# EAGLE design proto1 (EAGLE 7.7.0)
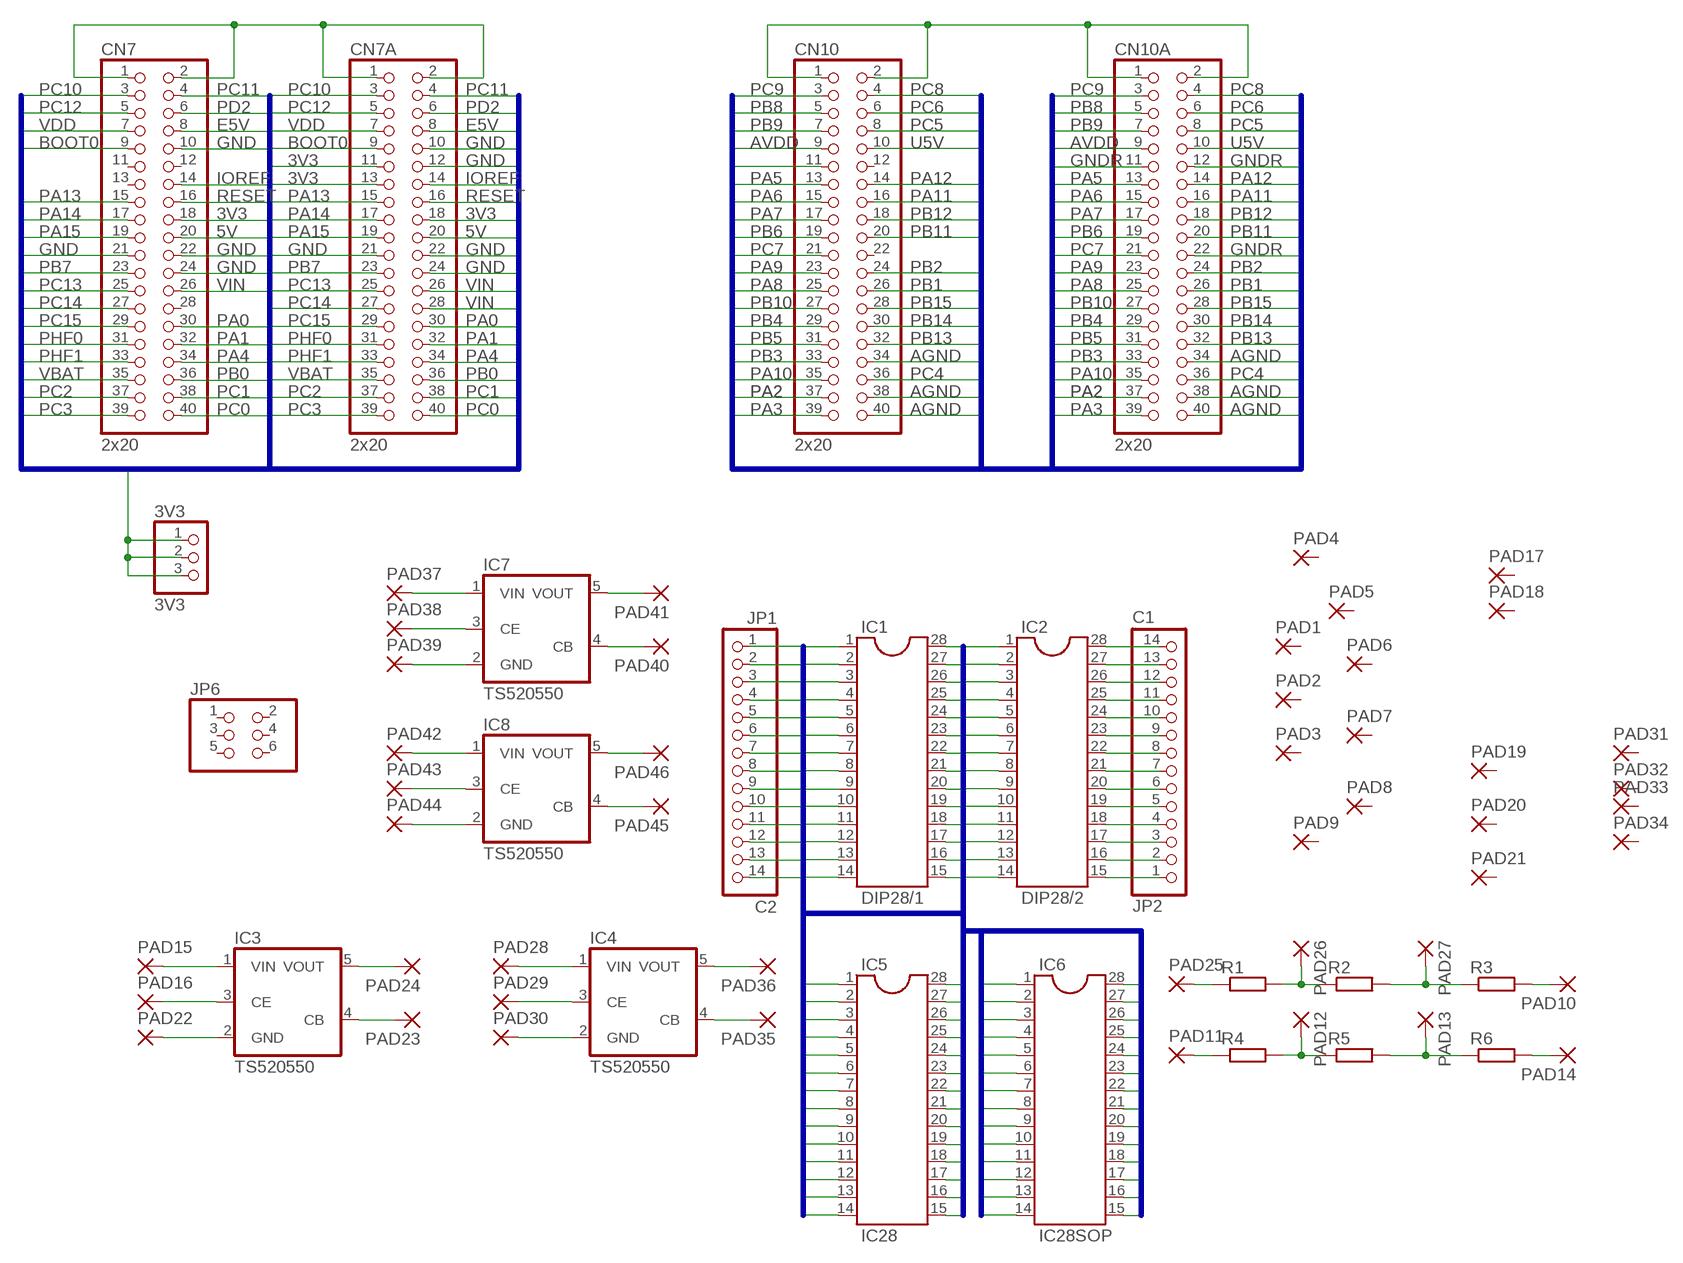
[diagram p0: schematic, sheet 1]

## Parts
3V3  3V3  PINHD-1X3  [1X03]
CN7  2x20  PINHD-2X20  [2X20]
CN7A  2x20  PINHD-2X20  [2X20]
CN10  2x20  PINHD-2X20  [2X20]
CN10A  2x20  PINHD-2X20  [2X20]
IC1  DIP28/1  DIL28  [DIL28-6]
IC2  DIP28/2  DIL28-3  [DIL28-3]
IC3  TS520550  [SOT25]
IC4  TS520550  [SOT25]
IC5  IC28  [SSOP28]
IC6  IC28SOP  [SOP28]
IC7  TS520550  [SOT25]
IC8  TS520550  [SOT25]
JP1  C2  PINHD-1X14  [1X14]
JP2  C1  PINHD-1X14  [1X14]
JP6  PINHD-2X3  [2X03]
PAD1  SMD2  [SMD1,27-2,54]
PAD2  SMD2  [SMD1,27-2,54]
PAD3  SMD2  [SMD1,27-2,54]
PAD4  SMD2  [SMD1,27-2,54]
PAD5  SMD2  [SMD1,27-2,54]
PAD6  SMD2  [SMD1,27-2,54]
PAD7  SMD2  [SMD1,27-2,54]
PAD8  SMD2  [SMD1,27-2,54]
PAD9  SMD2  [SMD1,27-2,54]
PAD10  SMD2  [SMD1,27-2,54]
PAD11  SMD2  [SMD1,27-2,54]
PAD12  SMD2  [SMD1,27-2,54]
PAD13  SMD2  [SMD1,27-2,54]
PAD14  SMD2  [SMD1,27-2,54]
PAD15  SMD2  [SMD1,27-2,54]
PAD16  SMD2  [SMD1,27-2,54]
PAD17  SMD2  [SMD1,27-2,54]
PAD18  SMD2  [SMD1,27-2,54]
PAD19  SMD2  [SMD1,27-2,54]
PAD20  SMD2  [SMD1,27-2,54]
PAD21  SMD2  [SMD1,27-2,54]
PAD22  SMD2  [SMD1,27-2,54]
PAD23  SMD2  [SMD1,27-2,54]
PAD24  SMD2  [SMD1,27-2,54]
PAD25  SMD2  [SMD1,27-2,54]
PAD26  SMD2  [SMD1,27-2,54]
PAD27  SMD2  [SMD1,27-2,54]
PAD28  SMD2  [SMD1,27-2,54]
PAD29  SMD2  [SMD1,27-2,54]
PAD30  SMD2  [SMD1,27-2,54]
PAD31  SMD2  [SMD1,27-2,54]
PAD32  SMD2  [SMD1,27-2,54]
PAD33  SMD2  [SMD1,27-2,54]
PAD34  SMD2  [SMD1,27-2,54]
PAD35  SMD2  [SMD1,27-2,54]
PAD36  SMD2  [SMD1,27-2,54]
PAD37  SMD2  [SMD1,27-2,54]
PAD38  SMD2  [SMD1,27-2,54]
PAD39  SMD2  [SMD1,27-2,54]
PAD40  SMD2  [SMD1,27-2,54]
PAD41  SMD2  [SMD1,27-2,54]
PAD42  SMD2  [SMD1,27-2,54]
PAD43  SMD2  [SMD1,27-2,54]
PAD44  SMD2  [SMD1,27-2,54]
PAD45  SMD2  [SMD1,27-2,54]
PAD46  SMD2  [SMD1,27-2,54]
R1  R-EU_R1206  [R1206]
R2  R-EU_R1206  [R1206]
R3  R-EU_R1206  [R1206]
R4  R-EU_R1206  [R1206]
R5  R-EU_R1206  [R1206]
R6  R-EU_R1206  [R1206]

## Nets
3V3: 3V3.1 3V3.2 3V3.3 CN7.18 CN7A.11 CN7A.13 CN7A.18
5V: CN7.20 CN7A.20
AGND: CN10.34 CN10.38 CN10.40 CN10A.34 CN10A.38 CN10A.40
AVDD: CN10.9 CN10A.9
BOOT0: CN7.9 CN7A.9
E5V: CN7.8 CN7A.8
GND: CN7.10 CN7.21 CN7.22 CN7.24 CN7A.10 CN7A.12 CN7A.21 CN7A.22 CN7A.24
GNDR: CN10.11 CN10A.11 CN10A.12 CN10A.22
IC1: IC1.1 IC5.1 IC6.28 JP1.1
IC2: IC1.2 IC5.2 IC6.27 JP1.2
IC3: IC1.3 IC5.3 IC6.26 JP1.3
IC4: IC1.4 IC5.4 IC6.25 JP1.4
IC5: IC1.5 IC5.5 IC6.24 JP1.5
IC6: IC1.6 IC5.6 IC6.23 JP1.6
IC7: IC1.7 IC5.7 IC6.22 JP1.7
IC8: IC1.8 IC5.8 IC6.21 JP1.8
IC9: IC1.9 IC5.9 IC6.20 JP1.9
IC10: IC1.10 IC5.10 IC6.19 JP1.10
IC11: IC1.11 IC5.11 IC6.18 JP1.11
IC12: IC1.12 IC5.12 IC6.17 JP1.12
IC13: IC1.13 IC5.13 IC6.16 JP1.13
IC14: IC1.14 IC5.14 IC6.15 JP1.14
IC15: IC1.15 IC2.14 IC5.15 IC6.14
IC16: IC1.16 IC2.13 IC5.16 IC6.13
IC17: IC1.17 IC2.12 IC5.17 IC6.12
IC18: IC1.18 IC2.11 IC5.18 IC6.11
IC19: IC1.19 IC2.10 IC5.19 IC6.10
IC20: IC1.20 IC2.9 IC5.20 IC6.9
IC21: IC1.21 IC2.8 IC5.21 IC6.8
IC22: IC1.22 IC2.7 IC5.22 IC6.7
IC23: IC1.23 IC2.6 IC5.23 IC6.6
IC24: IC1.24 IC2.5 IC5.24 IC6.5
IC25: IC1.25 IC2.4 IC5.25 IC6.4
IC26: IC1.26 IC2.3 IC5.26 IC6.3
IC27: IC1.27 IC2.2 IC5.27 IC6.2
IC28: IC1.28 IC2.1 IC5.28 IC6.1
IOREF: CN7.14 CN7A.14
N$1: CN10.1 CN10.2 CN10A.1 CN10A.2
N$2: CN7.1 CN7.2 CN7A.1 CN7A.2
N$3: IC2.28 JP2.14
N$4: IC2.27 JP2.13
N$5: IC2.26 JP2.12
N$6: IC2.25 JP2.11
N$7: IC2.24 JP2.10
N$8: IC2.23 JP2.9
N$9: IC2.22 JP2.8
N$10: IC2.21 JP2.7
N$11: IC2.20 JP2.6
N$12: IC2.19 JP2.5
N$13: IC2.18 JP2.4
N$14: IC2.17 JP2.3
N$15: IC2.16 JP2.2
N$16: IC2.15 JP2.1
N$17: PAD25.1(P) R1.1
N$18: PAD26.1(P) R1.2 R2.1
N$19: PAD27.1(P) R2.2 R3.1
N$20: PAD10.1(P) R3.2
N$21: PAD11.1(P) R4.1
N$22: PAD12.1(P) R4.2 R5.1
N$23: PAD13.1(P) R5.2 R6.1
N$24: PAD14.1(P) R6.2
N$25: IC3.1(VIN) PAD15.1(P)
N$26: IC3.3(CE) PAD16.1(P)
N$27: IC3.2(GND) PAD22.1(P)
N$28: IC3.4(CB) PAD23.1(P)
N$29: IC3.5(VOUT) PAD24.1(P)
N$30: IC4.1(VIN) PAD28.1(P)
N$31: IC4.3(CE) PAD29.1(P)
N$32: IC4.2(GND) PAD30.1(P)
N$33: IC4.4(CB) PAD35.1(P)
N$34: IC4.5(VOUT) PAD36.1(P)
N$35: IC7.1(VIN) PAD37.1(P)
N$36: IC7.3(CE) PAD38.1(P)
N$37: IC7.2(GND) PAD39.1(P)
N$38: IC7.4(CB) PAD40.1(P)
N$39: IC7.5(VOUT) PAD41.1(P)
N$40: IC8.1(VIN) PAD42.1(P)
N$41: IC8.3(CE) PAD43.1(P)
N$42: IC8.2(GND) PAD44.1(P)
N$43: IC8.4(CB) PAD45.1(P)
N$44: IC8.5(VOUT) PAD46.1(P)
PA0: CN7.30 CN7A.30
PA1: CN7.32 CN7A.32
PA2: CN10.37 CN10A.37
PA3: CN10.39 CN10A.39
PA4: CN7.34 CN7A.34
PA5: CN10.13 CN10A.13
PA6: CN10.15 CN10A.15
PA7: CN10.17 CN10A.17
PA8: CN10.25 CN10A.25
PA9: CN10.23 CN10A.23
PA10: CN10.35 CN10A.35
PA11: CN10.16 CN10A.16
PA12: CN10.14 CN10A.14
PA13: CN7.15 CN7A.15
PA14: CN7.17 CN7A.17
PA15: CN7.19 CN7A.19
PB0: CN7.36 CN7A.36
PB1: CN10.26 CN10A.26
PB2: CN10.24 CN10A.24
PB3: CN10.33 CN10A.33
PB4: CN10.29 CN10A.29
PB5: CN10.31 CN10A.31
PB6: CN10.19 CN10A.19
PB7: CN7.23 CN7A.23
PB8: CN10.5 CN10A.5
PB9: CN10.7 CN10A.7
PB10: CN10.27 CN10A.27
PB11: CN10.20 CN10A.20
PB12: CN10.18 CN10A.18
PB13: CN10.32 CN10A.32
PB14: CN10.30 CN10A.30
PB15: CN10.28 CN10A.28
PC0: CN7.40 CN7A.40
PC1: CN7.38 CN7A.38
PC2: CN7.37 CN7A.37
PC3: CN7.39 CN7A.39
PC4: CN10.36 CN10A.36
PC5: CN10.8 CN10A.8
PC6: CN10.6 CN10A.6
PC7: CN10.21 CN10A.21
PC8: CN10.4 CN10A.4
PC9: CN10.3 CN10A.3
PC10: CN7.3 CN7A.3
PC11: CN7.4 CN7A.4
PC12: CN7.5 CN7A.5
PC13: CN7.25 CN7A.25
PC14: CN7.27 CN7A.27
PC15: CN7.29 CN7A.29
PD2: CN7.6 CN7A.6
PHF0: CN7.31 CN7A.31
PHF1: CN7.33 CN7A.33
RESET: CN7.16 CN7A.16
U5V: CN10.10 CN10A.10
VBAT: CN7.35 CN7A.35
VDD: CN7.7 CN7A.7
VIN: CN7.26 CN7A.26 CN7A.28
Unconnected: CN7.11 CN7.12 CN7.13 CN7.28 CN10.12 CN10.22 JP6.1 JP6.2 JP6.3 JP6.4 JP6.5 JP6.6 PAD1.1(P) PAD2.1(P) PAD3.1(P) PAD4.1(P) PAD5.1(P) PAD6.1(P) PAD7.1(P) PAD8.1(P) PAD9.1(P) PAD17.1(P) PAD18.1(P) PAD19.1(P) PAD20.1(P) PAD21.1(P) PAD31.1(P) PAD32.1(P) PAD33.1(P) PAD34.1(P)

## Buses
CN7:3V3,5V,E5V,PA0,PA1,PA4,PA[13..15],PB0,PB7,PC[0..3],PC[9..15],PD2,PHF[0..1],GND,BOOT0,IOREF,VBAT,VDD,VIN,RESET
AVDD,GNDR,AGND,U5V,PA2,PA3,PA[5..12],PB[1..6],PB[8..15],PC[4..9]
IC[1..28]

## Library data of the parts
3V3 = pinhead:PINHD-1X3: PIN HEADER
CN7 CN7A CN10 CN10A = pinhead:PINHD-2X20: PIN HEADER
IC1 IC2 = ref-dev:DIL28: Dual In Line
IC3 IC4 IC7 IC8 = v-reg:TS5205: 150mA Low Noise LDO Voltage Regulator with Enable TSC [Taiwan Semiconductor Company, Ltd] Source: http://www.taiwansemi.com .. 5205_0409c.pdf
IC5 IC6 = ref-dev:IC28
JP1 JP2 = pinhead:PINHD-1X14: PIN HEADER
JP6 = pinhead:PINHD-2X3: PIN HEADER
PAD1-PAD46 = wirepad:SMD2: SMD PAD
R1-R6 = rcl:R-EU_: RESISTOR, European symbol

## Board
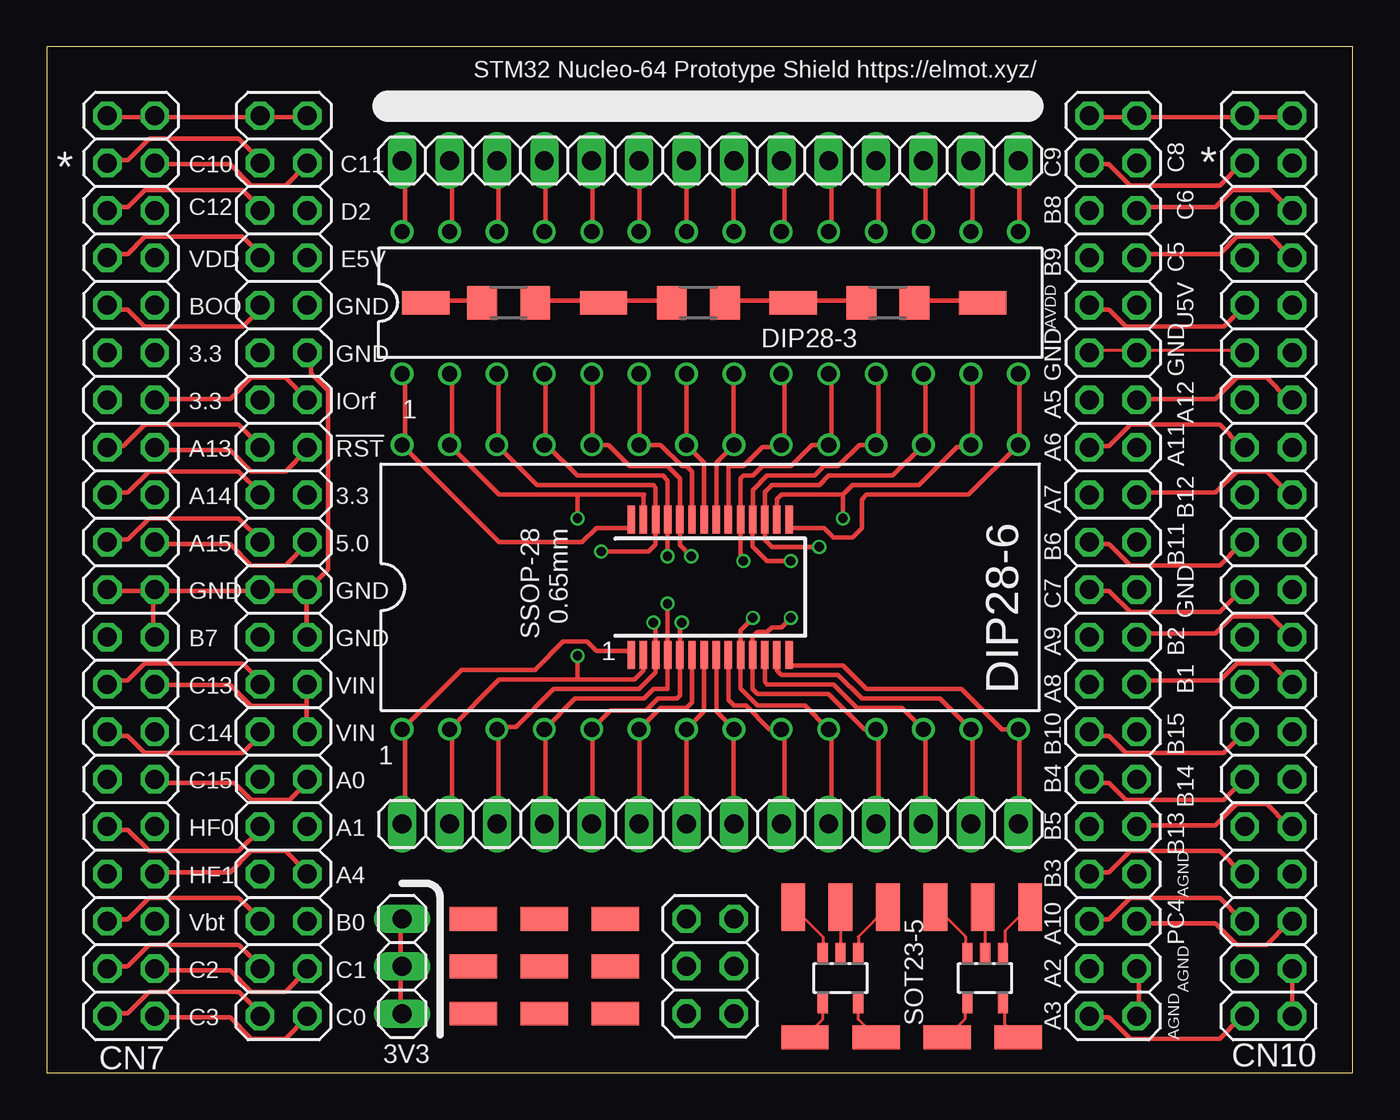
[diagram p1: board, top side]
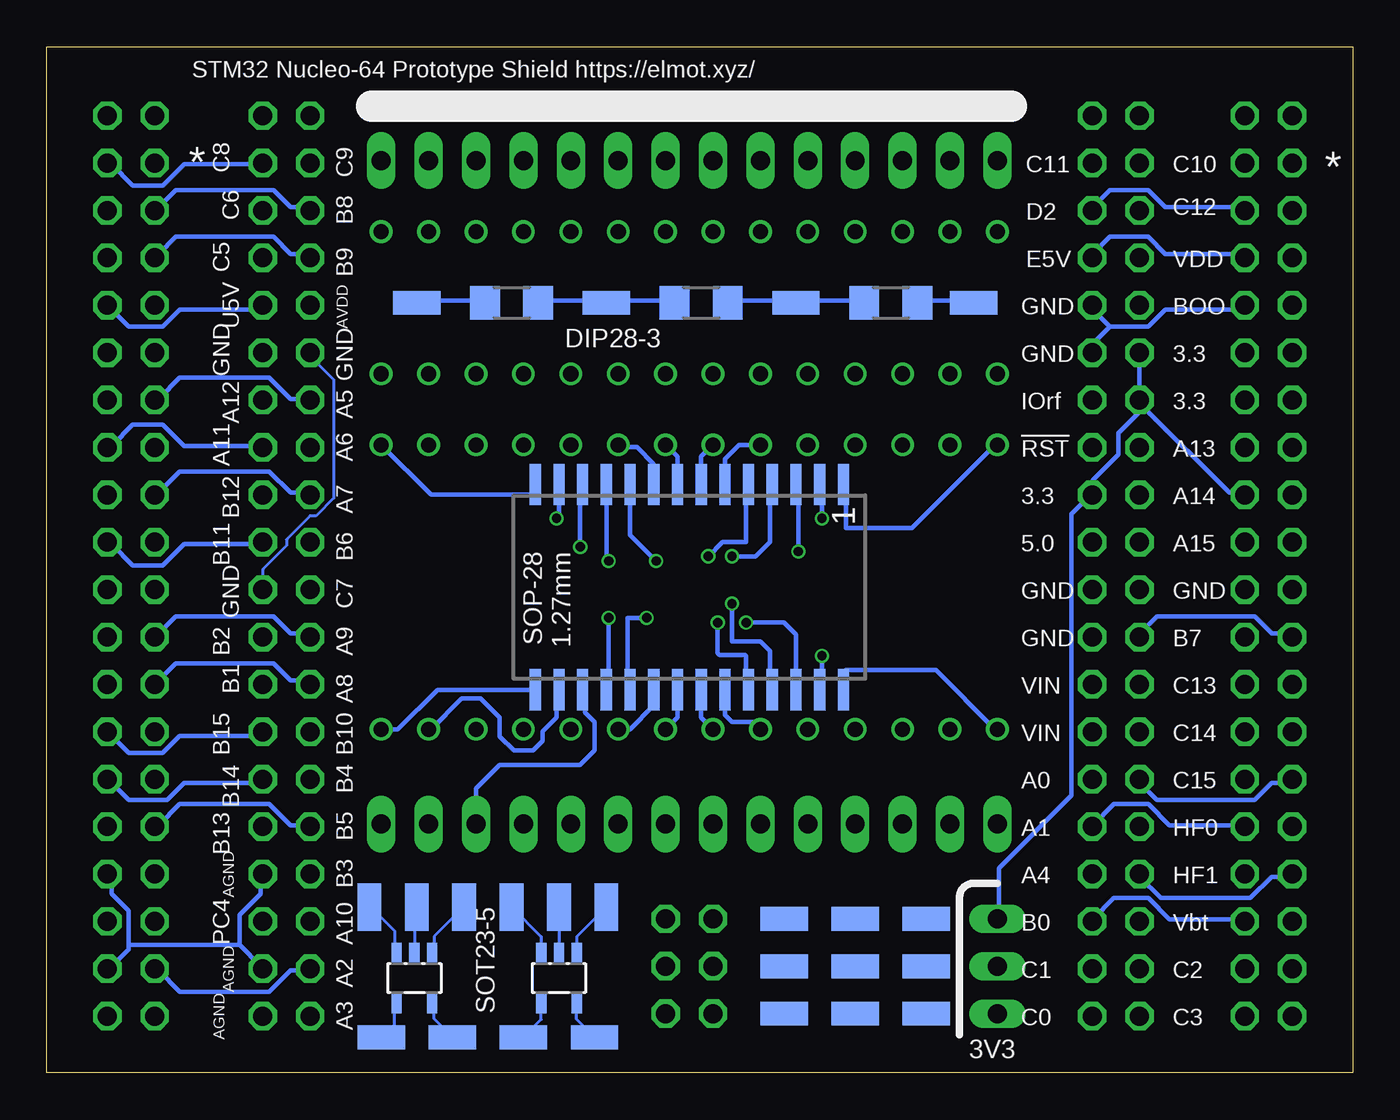
[diagram p2: board, bottom side, seen from below]

Size 70 x 55 mm. Coordinates in mm from the lower left corner, seen from the top.
Outline: 0,0 70,0 70,55 0,55 0,0
Copper layers (1*16): Top 0.035559375mm / dielectric 1.6mm / Bottom 0.035559375mm
Design rules "oshpark-2layer (1)": minimum track width 6mil, minimum drill 10mil, track to track 6mil, track to pad 6mil, pad to pad 6mil, via to via 6mil, smd to smd 6mil, copper to edge 15mil, drill to drill 6mil, minimum pad ring 5mil, minimum via ring 5mil, stop-mask expansion 2.5mil, vias tented up to drill 0mil, thermal gap 10mil

### Footprints (pad centres in the part's own frame; a part is rotated, then mirrored left to right if it is on the bottom)
1X03 = drill 1.016 long: 1 -2.54,0; 2 0,0; 3 2.54,0
2X20 = drill 1.016 octagon: 1 -24.13,-1.27; 2 -24.13,1.27; 3 -21.59,-1.27; 4 -21.59,1.27; 5 -19.05,-1.27; 6 -19.05,1.27; 7 -16.51,-1.27; 8 -16.51,1.27; 9 -13.97,-1.27; 10 -13.97,1.27; 11 -11.43,-1.27; 12 -11.43,1.27; 13 -8.89,-1.27; 14 -8.89,1.27; 15 -6.35,-1.27; 16 -6.35,1.27; 17 -3.81,-1.27; 18 -3.81,1.27; 19 -1.27,-1.27; 20 -1.27,1.27; 21 1.27,-1.27; 22 1.27,1.27; 23 3.81,-1.27; 24 3.81,1.27; 25 6.35,-1.27; 26 6.35,1.27; 27 8.89,-1.27; 28 8.89,1.27; 29 11.43,-1.27; 30 11.43,1.27; 31 13.97,-1.27; 32 13.97,1.27; 33 16.51,-1.27; 34 16.51,1.27; 35 19.05,-1.27; 36 19.05,1.27; 37 21.59,-1.27; 38 21.59,1.27; 39 24.13,-1.27; 40 24.13,1.27
DIL28-6 = drill 0.813: 1 -16.51,-7.62; 2 -13.97,-7.62; 3 -11.43,-7.62; 4 -8.89,-7.62; 5 -6.35,-7.62; 6 -3.81,-7.62; 7 -1.27,-7.62; 8 1.27,-7.62; 9 3.81,-7.62; 10 6.35,-7.62; 11 8.89,-7.62; 12 11.43,-7.62; 13 13.97,-7.62; 14 16.51,-7.62; 15 16.51,7.62; 16 13.97,7.62; 17 11.43,7.62; 18 8.89,7.62; 19 6.35,7.62; 20 3.81,7.62; 21 1.27,7.62; 22 -1.27,7.62; 23 -3.81,7.62; 24 -6.35,7.62; 25 -8.89,7.62; 26 -11.43,7.62; 27 -13.97,7.62; 28 -16.51,7.62
DIL28-3 = drill 0.813: 1 -16.51,-3.81; 2 -13.97,-3.81; 3 -11.43,-3.81; 4 -8.89,-3.81; 5 -6.35,-3.81; 6 -3.81,-3.81; 7 -1.27,-3.81; 8 1.27,-3.81; 9 3.81,-3.81; 10 6.35,-3.81; 11 8.89,-3.81; 12 11.43,-3.81; 13 13.97,-3.81; 14 16.51,-3.81; 15 16.51,3.81; 16 13.97,3.81; 17 11.43,3.81; 18 8.89,3.81; 19 6.35,3.81; 20 3.81,3.81; 21 1.27,3.81; 22 -1.27,3.81; 23 -3.81,3.81; 24 -6.35,3.81; 25 -8.89,3.81; 26 -11.43,3.81; 27 -13.97,3.81; 28 -16.51,3.81
SOT25 = smd 0.55 x 1.2: 1 -0.95,-1.3; 2 0,-1.3; 3 0.95,-1.3; 4 0.95,1.3; 5 -0.95,1.3
SSOP28 = smd 0.4 x 1.5: 1 -4.225,-3.625; 2 -3.575,-3.625; 3 -2.925,-3.625; 4 -2.275,-3.625; 5 -1.625,-3.625; 6 -0.975,-3.625; 7 -0.325,-3.625; 8 0.325,-3.625; 9 0.975,-3.625; 10 1.625,-3.625; 11 2.275,-3.625; 12 2.925,-3.625; 13 3.575,-3.625; 14 4.225,-3.625; 15 4.225,3.625; 16 3.575,3.625; 17 2.925,3.625; 18 2.275,3.625; 19 1.625,3.625; 20 0.975,3.625; 21 0.325,3.625; 22 -0.325,3.625; 23 -0.975,3.625; 24 -1.625,3.625; 25 -2.275,3.625; 26 -2.925,3.625; 27 -3.575,3.625; 28 -4.225,3.625
SOP28 = smd 0.6 x 2.2: 1 -8.255,-5.5; 2 -6.985,-5.5; 3 -5.715,-5.5; 4 -4.445,-5.5; 5 -3.175,-5.5; 6 -1.905,-5.5; 7 -0.635,-5.5; 8 0.635,-5.5; 9 1.905,-5.5; 10 3.175,-5.5; 11 4.445,-5.5; 12 5.715,-5.5; 13 6.985,-5.5; 14 8.255,-5.5; 15 8.255,5.5; 16 6.985,5.5; 17 5.715,5.5; 18 4.445,5.5; 19 3.175,5.5; 20 1.905,5.5; 21 0.635,5.5; 22 -0.635,5.5; 23 -1.905,5.5; 24 -3.175,5.5; 25 -4.445,5.5; 26 -5.715,5.5; 27 -6.985,5.5; 28 -8.255,5.5
1X14 = drill 1.016 long: 1 -16.51,0; 2 -13.97,0; 3 -11.43,0; 4 -8.89,0; 5 -6.35,0; 6 -3.81,0; 7 -1.27,0; 8 1.27,0; 9 3.81,0; 10 6.35,0; 11 8.89,0; 12 11.43,0; 13 13.97,0; 14 16.51,0
2X03 = drill 1.016 octagon: 1 -2.54,-1.27; 2 -2.54,1.27; 3 0,-1.27; 4 0,1.27; 5 2.54,-1.27; 6 2.54,1.27
SMD1,27-2,54 = smd 1.27 x 2.54: 1 0,0
R1206 = smd 1.6 x 1.803: 1 -1.422,0; 2 1.422,0

### Placement (x,y rotation side)
3V3  19.05,5.71 90 top
CN7  4.52,27.17 270 top
CN7A  12.7,27.17 270 top
CN10  65.48,27.17 270 top
CN10A  57.15,27.17 270 top
IC1  35.56,26.04 0 top
IC2  35.56,41.27 0 top
IC3  42.55,5.08 180 top
IC4  42.55,5.08 180 bottom
IC5  35.56,26.04 0 top
IC6  35.56,26.04 180 bottom
IC7  50.29,5.08 180 top
IC8  50.29,5.08 180 bottom
JP1  35.56,13.34 0 top
JP2  35.56,48.9 180 top
JP6  35.56,5.71 90 top
PAD1  22.86,8.26 90 top
PAD2  22.86,5.71 90 top
PAD3  22.86,3.17 90 top
PAD4  26.67,8.26 270 top
PAD5  26.67,5.71 90 top
PAD6  26.67,3.17 90 top
PAD7  30.48,8.26 90 top
PAD8  30.48,5.71 90 top
PAD9  30.48,3.17 90 top
PAD10  50.16,41.27 90 top
PAD11  20.32,41.27 270 bottom
PAD12  29.84,41.27 270 bottom
PAD13  40.01,41.27 270 bottom
PAD14  50.16,41.27 270 bottom
PAD15  45.09,8.89 180 top
PAD16  40.01,8.89 180 top
PAD17  22.86,5.71 270 bottom
PAD18  22.86,8.26 270 bottom
PAD19  30.48,8.26 90 bottom
PAD20  30.48,5.71 270 bottom
PAD21  30.48,3.17 270 bottom
PAD22  42.55,8.89 0 top
PAD23  40.64,1.91 90 top
PAD24  44.45,1.91 90 top
PAD25  20.32,41.27 90 top
PAD26  29.84,41.27 90 top
PAD27  40.01,41.27 90 top
PAD28  40.01,8.89 180 bottom
PAD29  45.09,8.89 0 bottom
PAD30  42.55,8.89 0 bottom
PAD31  26.67,8.26 90 bottom
PAD32  26.67,5.71 270 bottom
PAD33  22.86,3.17 90 bottom
PAD34  26.67,3.17 270 bottom
PAD35  44.45,1.91 90 bottom
PAD36  40.64,1.91 270 bottom
PAD37  52.7,8.89 0 top
PAD38  47.62,8.89 180 top
PAD39  50.16,8.89 0 top
PAD40  48.26,1.91 90 top
PAD41  52.07,1.91 270 top
PAD42  47.62,8.89 0 bottom
PAD43  52.7,8.89 0 bottom
PAD44  50.16,8.89 0 bottom
PAD45  52.07,1.91 90 bottom
PAD46  48.26,1.91 270 bottom
R1  24.77,41.27 0 top
R2  34.92,41.27 0 top
R3  45.09,41.27 0 top
R4  24.77,41.27 180 bottom
R5  34.92,41.27 180 bottom
R6  45.09,41.27 180 bottom

### Tracks (layer width: path | path; a pad name or v marks a point on that pad's centre or on a via)
3V3
  Top 0.254: 18.97,5.71 18.97,3.2 3V3.1 | 18.97,5.71 18.97,8.23 3V3.3 | 18.97,5.71 3V3.2
  Bottom 0.254: 11.2,35.66 11.43,35.89 CN7A.13 | 11.2,35.66 6.63,31.09 5.94,31.09 CN7.18 | 11.2,35.66 12.57,34.29 12.57,33.15 13.95,31.77 13.95,31.09 CN7A.18 14.17,30.86 15.09,29.95 15.09,14.86 18.97,10.97 18.97,8.46 3V3.3 | 11.2,35.66 CN7A.13 | CN7A.13 CN7A.11
5V
  Top 0.254: CN7.20 5.94,28.35 9.83,28.35 10.97,27.2 12.8,27.2 13.95,28.35 CN7A.20
AGND
  Top 0.254: CN10A.40 58.52,3.2 58.52,5.49 CN10A.38 | CN10.40 66.75,3.2 66.75,5.49 CN10.38
  Bottom 0.254: 59.66,6.86 59.66,8.46 58.52,9.6 58.52,10.52 CN10A.34 | 59.66,6.86 58.52,5.71 CN10A.38 | 65.61,6.86 65.61,6.63 66.52,5.71 CN10.38 | 65.61,6.86 65.61,8.69 66.52,9.6 66.52,10.52 CN10.34 | 65.61,6.86 59.66,6.86
AVDD
  Top 0.254: CN10A.9 56.01,40.92 56.92,40.92 57.84,40.01 63.09,40.01 64.01,40.92 CN10.9
BOOT0
  Top 0.254: CN7.9 3.43,40.92 4.34,40.92 5.26,40.01 10.52,40.01 11.43,40.92 CN7A.9
E5V
  Bottom 0.254: CN7.8 5.94,43.89 10.06,43.89 10.97,44.81 13.03,44.81 13.95,43.89 CN7A.8
GND
  Top 0.254: 5.71,25.83 5.71,23.55 CN7.24 | 5.71,25.83 3.43,25.83 CN7.21 | 5.71,25.83 CN7.22 5.94,25.83 11.43,25.83 | 13.95,25.83 11.43,25.83 | 13.95,25.83 13.95,23.55 CN7A.24 | 13.95,25.83 CN7A.22 14.17,26.06 15.09,26.98 15.09,36.58 14.17,37.49 14.17,38.41 CN7A.12 | 11.43,25.83 CN7A.21
  Bottom 0.254: 13.03,40.01 10.97,40.01 10.06,40.92 5.94,40.92 CN7.10 | 13.03,40.01 13.95,40.92 CN7A.10 | 13.03,40.01 13.95,39.09 13.95,38.63 CN7A.12
GNDR
  Top 0.152: 58.42,38.73 55.88,38.73 CN10A.11 | 58.42,38.73 64.14,38.73 CN10.11 | 58.42,38.73 CN10A.12
  Bottom 0.152: CN10A.22 58.42,26.99 57.15,28.26 57.15,28.57 55.88,29.84 55.56,29.84 54.61,30.8 54.61,37.15 55.88,38.42 CN10A.11
IC1
  Top 0.254: JP1.1 19.2,13.49 19.2,18.29 IC1.1 22.23,21.59 26.16,21.59 27.69,23.11 28.96,23.11 29.46,22.61 31.14,22.61 IC5.1
  Bottom 0.254: IC6.28 27.18,20.66 27.18,21.59 22.35,21.59 19.18,18.41 IC1.1
IC2  (via drill 0.5)
  Top 0.254: JP1.2 21.72,13.49 21.72,18.29 IC1.2 24.26,21.08 28.45,21.08 | IC5.2 31.98,21.57 31.5,21.08 28.45,21.08 | v28.45,22.35 28.45,21.08
  Bottom 0.254: IC6.27 28.7,20.66 28.45,20.92 v28.45,22.35
IC3  (via drill 0.5)
  Top 0.254: JP1.3 24.23,13.49 24.23,18.29 IC1.3 24.26,18.54 25.15,18.54 27.18,20.57 31.75,20.57 32.63,21.46 IC5.3 32.63,24.01 v32.51,24.13
  Bottom 0.254: IC6.26 29.84,23.5 30.48,24.13 v32.51,24.13
IC4  (via drill 0.5)
  Top 0.254: JP1.4 26.75,13.49 26.75,18.29 IC1.4 28.32,20.07 32,20.07 32.51,20.57 33.27,20.57 33.28,20.59 IC5.4 33.28,25.14 v33.27,25.15
  Bottom 0.254: IC6.25 31.24,20.66 31.24,22.61 31.75,23.11 33.27,23.11 v33.27,25.15
IC5  (via drill 0.5)
  Top 0.254: JP1.5 29.26,13.49 29.26,18.29 IC1.5 30.23,19.43 32.13,19.43 32.77,20.07 33.78,20.07 33.94,20.22 IC5.5 33.94,24.03 v34.04,24.13
  Bottom 0.254: IC6.24 32.38,19.68 32.51,19.81 32.51,22.35 32.57,22.41 IC5.5 34.04,22.51 v34.04,24.13
IC6
  Top 0.254: JP1.6 31.77,13.49 31.77,18.29 IC1.6 32.89,19.56 34.29,19.56 34.59,19.85 IC5.6
  Bottom 0.254: IC6.23 33.66,19.18 33.27,18.8 32.13,18.8 IC1.6
IC7
  Top 0.254: JP1.7 IC1.7 35.23,19.36 IC5.7
  Bottom 0.254: IC6.22 34.92,19.05 IC1.7
IC8
  Top 0.254: JP1.8 36.8,13.49 36.8,18.29 IC1.8 35.88,19.36 IC5.8
  Bottom 0.254: IC6.21 36.2,19.05 IC1.8
IC9
  Top 0.254: JP1.9 39.55,13.49 39.55,18.29 IC1.9 38.73,18.41 37.47,19.68 36.83,19.68 36.53,19.98 IC5.9
  Bottom 0.254: IC6.20 37.47,19.68 38.73,18.41 IC1.9
IC10  (via drill 0.5)
  Top 0.254: JP1.10 42.06,13.49 42.06,18.29 IC1.10 40.64,19.68 38.1,19.68 37.19,20.6 IC5.10 37.19,23.72 v37.85,24.38
  Bottom 0.254: IC6.19 38.86,20.66 38.86,24.38 v37.85,24.38
IC11  (via drill 0.5)
  Top 0.254: JP1.11 44.58,13.49 44.58,18.29 IC1.11 43.81,18.41 41.91,20.32 38.1,20.32 37.84,20.59 IC5.11 37.84,23.36 38.1,23.62 38.61,23.62 38.86,23.88 39.37,23.88 v39.88,24.38
  Bottom 0.254: IC6.18 39.88,20.66 v39.88,24.38
IC12
  Top 0.254: JP1.12 47.09,13.49 47.09,18.29 IC1.12 45.85,19.56 43.43,19.56 42.16,20.83 38.61,20.83 38.48,20.95 IC5.12
  Bottom 0.254: IC6.17 41.15,20.41 41.15,19.3 40.64,18.8 40.64,17.27 41.4,16.51 45.72,16.51 46.99,15.24 JP1.12
IC13
  Top 0.254: JP1.13 49.61,13.49 49.61,18.29 IC1.13 47.88,20.07 43.69,20.07 42.42,21.34 39.37,21.34 39.13,21.57 IC5.13
  Bottom 0.254: IC6.16 42.67,20.41 42.67,19.05 43.43,18.29 43.43,17.78 43.94,17.27 44.96,17.27 45.72,18.03 45.72,19.05 46.74,20.07 47.75,20.07 49.4,18.41 IC1.13
IC14
  Top 0.254: JP1.14 52.12,13.49 52.12,18.29 IC1.14 51.18,18.41 49.02,20.57 43.94,20.57 42.67,21.84 39.78,21.84 IC5.14
  Bottom 0.254: IC6.15 49.06,20.54 51.18,18.41 IC1.14
IC15
  Top 0.254: IC2.14 52.12,37.26 52.12,33.83 IC1.15 49.4,30.99 43.94,30.99 43.69,30.73 43.69,29.21 43.18,28.7 42.16,28.7 41.66,29.21 39.78,29.21 IC5.15
  Bottom 0.254: IC6.14 43.81,31.11 43.94,30.99 49.4,30.99 IC1.15
IC16  (via drill 0.5)
  Top 0.254: IC2.13 49.61,37.26 49.61,33.83 IC1.16 49.4,33.53 48.77,33.53 46.74,31.5 43.18,31.5 42.67,30.99 | IC5.16 39.13,30.75 39.37,30.99 42.67,30.99 | v42.67,29.72 42.67,30.99
  Bottom 0.254: IC6.13 42.55,29.72 v42.67,29.72
IC17  (via drill 0.5)
  Top 0.254: IC2.12 47.09,37.26 47.09,33.83 IC1.17 45.34,32 41.91,32 41.4,31.5 38.86,31.5 38.48,31.12 IC5.17 38.48,28.57 38.86,28.19 v41.4,28.19
  Bottom 0.254: IC6.12 41.4,31.41 v41.4,28.19
IC18  (via drill 0.5)
  Top 0.254: IC2.11 44.58,37.26 44.58,33.83 IC1.18 43.56,33.66 42.42,32.51 41.66,32.51 41.15,32 38.61,32 37.85,31.24 IC5.18 37.84,28.2 38.61,27.43 v39.88,27.43
  Bottom 0.254: IC6.11 40.01,27.56 v39.88,27.43
IC19  (via drill 0.5)
  Top 0.254: IC2.10 42.06,37.26 42.06,33.83 IC1.19 41.02,33.66 39.88,32.51 38.35,32.51 37.85,32 37.34,32 37.19,31.85 IC5.19 37.19,27.59 v37.34,27.43
  Bottom 0.254: IC6.10 38.73,28.83 v37.34,27.43
IC20
  Top 0.254: IC2.9 39.55,37.26 39.55,33.83 IC1.20 39.24,33.53 38.35,33.53 37.34,32.51 36.58,32.51 36.53,32.47 IC5.20
  Bottom 0.254: IC6.9 37.47,32.64 38.35,33.53 39.24,33.53 IC1.20
IC21
  Top 0.254: IC2.8 36.8,37.26 36.8,33.83 IC1.21 35.88,32.71 IC5.21
  Bottom 0.254: IC6.8 36.2,33.02 IC1.21
IC22
  Top 0.254: IC2.7 IC1.22 35.23,32.71 IC5.22
  Bottom 0.254: IC6.7 34.92,33.02 IC1.22
IC23
  Top 0.254: IC2.6 31.77,37.26 31.77,33.83 IC1.23 32.89,33.66 34.04,32.51 34.29,32.51 34.59,32.22 IC5.23
  Bottom 0.254: IC6.6 33.66,32.89 32.89,33.66 IC1.23
IC24  (via drill 0.5)
  Top 0.254: IC2.5 29.26,37.26 29.26,33.83 IC1.24 30.1,33.66 31.24,32.51 33.27,32.51 33.94,31.85 IC5.24 33.94,28.3 v34.54,27.69
  Bottom 0.254: IC6.5 32.51,31.41 32.51,28.45 33.78,28.45 v34.54,27.69
IC25  (via drill 0.5)
  Top 0.254: IC2.4 26.75,37.26 26.75,33.83 IC1.25 26.8,33.66 28.45,32 33.02,32 33.27,31.75 33.27,29.67 IC5.25 33.28,27.7 v33.27,27.69
  Bottom 0.254: IC6.4 31.24,31.41 31.24,28.45 32,27.69 v33.27,27.69
IC26  (via drill 0.5)
  Top 0.254: IC2.3 24.23,37.26 24.23,33.83 IC1.26 26.29,31.5 32.51,31.5 32.63,31.37 IC5.26 32.63,28.32 32.26,27.94 v29.72,27.94
  Bottom 0.254: IC6.3 29.72,31.41 v29.72,27.94
IC27  (via drill 0.5)
  Top 0.254: IC2.2 21.72,37.26 21.72,33.83 IC1.27 24.26,30.99 28.45,30.99 | IC5.27 31.98,30.97 32,30.99 28.45,30.99 | v28.45,29.72 28.45,30.99
  Bottom 0.254: IC6.2 28.45,31.41 v28.45,29.72
IC28
  Top 0.254: IC2.1 19.2,37.26 19.2,33.83 IC1.28 24.26,28.45 28.7,28.45 29.46,29.21 31.24,29.21 31.34,29.3 IC5.28
  Bottom 0.254: IC6.1 27.18,31.41 27.18,29.21 23.62,29.21 19.18,33.66 IC1.28
IOREF
  Top 0.254: CN7.14 5.94,36.12 9.83,36.12 10.97,37.26 12.8,37.26 13.95,36.12 CN7A.14
N$1
  Top 0.254: CN10A.1 56.01,51.21 58.29,51.21 CN10A.2 58.52,51.21 64.01,51.21 CN10.1 64.24,51.21 66.52,51.21 CN10.2
N$2
  Top 0.254: CN7.1 3.43,51.21 5.71,51.21 CN7.2 5.94,51.21 11.43,51.21 | 11.43,51.21 13.95,51.21 CN7A.2 | 11.43,51.21 CN7A.1
N$3
  Top 0.254: IC2.28 19.2,45.26 19.2,48.69 JP2.14
N$4
  Top 0.254: IC2.27 21.72,45.26 21.72,48.69 JP2.13
N$5
  Top 0.254: IC2.26 24.23,45.26 24.23,48.69 JP2.12
N$6
  Top 0.254: IC2.25 26.75,45.26 26.75,48.69 JP2.11
N$7
  Top 0.254: IC2.24 29.26,45.26 29.26,48.69 JP2.10
N$8
  Top 0.254: IC2.23 31.77,45.26 31.77,48.69 JP2.9
N$9
  Top 0.254: JP2.8 IC2.22
N$10
  Top 0.254: IC2.21 36.8,45.26 36.8,48.69 JP2.7
N$11
  Top 0.254: IC2.20 39.55,45.26 39.55,48.69 JP2.6
N$12
  Top 0.254: IC2.19 42.06,45.26 42.06,48.69 JP2.5
N$13
  Top 0.254: IC2.18 44.58,45.26 44.58,48.69 JP2.4
N$14
  Top 0.254: IC2.17 47.09,45.26 47.09,48.69 JP2.3
N$15
  Top 0.254: IC2.16 49.61,45.26 49.61,48.69 JP2.2
N$16
  Top 0.254: IC2.15 52.12,45.26 52.12,48.69 JP2.1
N$17
  Top 0.254: R1.1 23.32,41.38 20.34,41.38 PAD25.1
N$18
  Top 0.254: R1.2 26.29,41.38 29.72,41.38 PAD26.1 29.95,41.38 33.38,41.38 R2.1
N$19
  Top 0.254: 40.01,41.38 36.35,41.38 R2.2 | 40.01,41.38 43.66,41.38 R3.1 | 40.01,41.38 PAD27.1
N$20
  Top 0.254: R3.2 46.63,41.38 50.06,41.38 PAD10.1
N$21
  Bottom 0.254: R4.1 23.32,41.38 20.34,41.38 PAD11.1
N$22
  Bottom 0.254: R4.2 26.29,41.38 29.72,41.38 PAD12.1 29.95,41.38 33.38,41.38 R5.1
N$23
  Bottom 0.254: 40.01,41.38 36.35,41.38 R5.2 | 40.01,41.38 43.66,41.38 R6.1 | 40.01,41.38 PAD13.1
N$24
  Bottom 0.254: R6.2 46.63,41.38 50.06,41.38 PAD14.1
N$25
  Top 0.152: PAD15.1 43.5,7.3 43.5,6.51 IC3.1
N$26
  Top 0.152: PAD16.1 41.59,7.3 41.59,6.51 IC3.3
N$27
  Top 0.152: PAD22.1 IC3.2
N$28
  Top 0.152: PAD23.1 41.59,2.86 41.59,3.65 IC3.4
N$29
  Top 0.152: PAD24.1 43.5,2.86 43.5,3.65 IC3.5
N$30
  Bottom 0.152: PAD28.1 41.59,7.3 41.59,6.51 IC4.1
N$31
  Bottom 0.152: PAD29.1 43.5,7.3 43.5,6.51 IC4.3
N$32
  Bottom 0.152: PAD30.1 IC4.2
N$33
  Bottom 0.152: PAD35.1 43.5,2.86 43.5,3.65 IC4.4
N$34
  Bottom 0.152: PAD36.1 41.59,2.86 41.59,3.65 IC4.5
N$35
  Top 0.152: IC7.1 51.36,6.4 51.36,7.62 52.58,8.84 PAD37.1
N$36
  Top 0.152: IC7.3 49.23,6.4 49.23,7.32 47.7,8.84 PAD38.1
N$37
  Top 0.152: IC7.2 50.29,8.84 PAD39.1
N$38
  Top 0.152: IC7.4 49.23,3.66 49.23,2.9 48.31,1.98 PAD40.1
N$39
  Top 0.152: IC7.5 51.36,3.66 51.36,2.59 51.97,1.98 PAD41.1
N$40
  Bottom 0.152: IC8.1 49.23,6.4 49.23,7.32 47.7,8.84 PAD42.1
N$41
  Bottom 0.152: IC8.3 51.36,6.4 51.36,7.62 52.58,8.84 PAD43.1
N$42
  Bottom 0.152: IC8.2 50.29,8.84 PAD44.1
N$43
  Bottom 0.152: IC8.4 51.36,3.66 51.36,2.59 51.97,1.98 PAD45.1
N$44
  Bottom 0.152: IC8.5 49.23,3.66 49.23,2.9 48.31,1.98 PAD46.1
PA0
  Top 0.254: CN7.30 5.94,15.54 10.06,15.54 10.97,14.63 13.03,14.63 13.95,15.54 CN7A.30
PA1
  Bottom 0.254: CN7.32 5.94,13.26 9.83,13.26 10.97,14.4 12.8,14.4 13.95,13.26 CN7A.32
PA2
  Bottom 0.254: CN10A.37 56.01,5.49 56.92,5.49 58.06,4.34 62.87,4.34 64.01,5.49 CN10.37
PA3
  Top 0.254: CN10A.39 56.01,2.97 56.92,2.97 58.06,1.83 62.87,1.83 64.01,2.97 CN10.39
PA4
  Top 0.254: CN7.34 5.94,10.74 9.83,10.74 10.97,11.89 12.8,11.89 13.95,10.74 CN7A.34
PA5
  Bottom 0.254: CN10A.13 56.01,36.12 56.92,36.12 58.06,37.26 62.87,37.26 64.01,36.12 CN10.13
PA6
  Top 0.254: CN10A.15 56.01,33.6 56.92,33.6 58.06,34.75 62.87,34.75 64.01,33.6 CN10.15
PA7
  Bottom 0.254: CN10A.17 56.01,31.09 56.92,31.09 58.06,32.23 62.87,32.23 64.01,31.09 CN10.17
PA8
  Bottom 0.254: CN10A.25 56.01,21.03 56.92,21.03 57.84,21.95 63.09,21.95 64.01,21.03 CN10.25
PA9
  Bottom 0.254: CN10A.23 56.01,23.55 56.92,23.55 57.84,24.46 63.09,24.46 64.01,23.55 CN10.23
PA10
  Top 0.254: CN10A.35 56.01,8.23 56.92,8.23 58.06,9.37 62.87,9.37 64.01,8.23 CN10.35
PA11
  Bottom 0.254: CN10A.16 58.52,33.6 62.64,33.6 63.78,34.75 65.38,34.75 66.52,33.6 CN10.16
PA12
  Top 0.254: CN10A.14 58.52,36.12 62.64,36.12 63.78,37.26 65.38,37.26 66.52,36.12 CN10.14
PA13
  Top 0.254: CN7.15 3.43,33.6 4.12,33.6 5.26,34.75 10.29,34.75 11.43,33.6 CN7A.15
PA14
  Top 0.254: CN7.17 3.43,31.09 4.34,31.09 5.49,32.23 10.29,32.23 11.43,31.09 CN7A.17
PA15
  Top 0.254: CN7.19 3.43,28.57 4.34,28.57 5.49,29.72 10.29,29.72 11.43,28.57 CN7A.19
PB0
  Bottom 0.254: CN7.36 5.94,8.23 9.83,8.23 10.97,9.37 12.8,9.37 13.95,8.23 CN7A.36
PB1
  Top 0.254: CN10A.26 58.52,21.03 62.87,21.03 63.78,21.95 65.61,21.95 66.52,21.03 CN10.26
PB2
  Top 0.254: CN10A.24 58.52,23.55 62.64,23.55 63.55,24.46 65.61,24.46 66.52,23.55 CN10.24
PB3
  Top 0.254: CN10A.33 56.01,10.74 56.92,10.74 58.06,11.89 62.87,11.89 64.01,10.74 CN10.33
PB4
  Top 0.254: CN10A.29 56.01,15.54 56.92,15.54 57.84,14.63 63.09,14.63 64.01,15.54 CN10.29
PB5
  Bottom 0.254: CN10A.31 56.01,13.26 56.92,13.26 58.06,14.4 62.87,14.4 64.01,13.26 CN10.31
PB6
  Top 0.254: CN10A.19 56.01,28.35 56.92,28.35 58.06,27.2 62.87,27.2 64.01,28.35 CN10.19
PB7
  Bottom 0.254: CN7.23 3.43,23.55 4.34,23.55 5.26,24.46 10.52,24.46 11.43,23.55 CN7A.23
PB8
  Bottom 0.254: CN10A.5 56.01,46.41 56.92,46.41 57.84,47.32 63.09,47.32 64.01,46.41 CN10.5
PB9
  Bottom 0.254: CN10A.7 56.01,43.89 56.92,43.89 57.84,44.81 63.09,44.81 64.01,43.89 CN10.7
PB10
  Top 0.254: CN10A.27 56.01,18.06 56.92,18.06 57.84,17.14 63.09,17.14 64.01,18.06 CN10.27
PB11
  Bottom 0.254: CN10A.20 58.52,28.35 62.64,28.35 63.78,27.2 65.38,27.2 66.52,28.35 CN10.20
PB12
  Top 0.254: CN10A.18 58.52,31.09 62.64,31.09 63.78,32.23 65.38,32.23 66.52,31.09 CN10.18
PB13
  Top 0.254: CN10A.32 58.52,13.26 62.64,13.26 63.78,14.4 65.38,14.4 66.52,13.26 CN10.32
PB14
  Bottom 0.254: CN10A.30 58.52,15.54 62.64,15.54 63.55,14.63 65.61,14.63 66.52,15.54 CN10.30
PB15
  Bottom 0.254: CN10A.28 58.52,18.06 62.87,18.06 63.78,17.14 65.61,17.14 66.52,18.06 CN10.28
PC0
  Top 0.254: CN7.40 5.94,2.97 9.83,2.97 10.97,1.83 12.8,1.83 13.95,2.97 CN7A.40
PC1
  Top 0.254: CN7.38 5.94,5.49 9.83,5.49 10.97,4.34 12.8,4.34 13.95,5.49 CN7A.38
PC2
  Top 0.254: CN7.37 3.43,5.71 4.34,5.71 5.49,6.86 10.29,6.86 11.43,5.71 CN7A.37
PC3
  Top 0.254: CN7.39 3.43,3.2 4.34,3.2 5.49,4.34 10.29,4.34 11.43,3.2 CN7A.39
PC4
  Top 0.254: CN10A.36 58.52,8 62.64,8 63.78,6.86 65.38,6.86 66.52,8 CN10.36
PC5
  Top 0.254: CN10A.8 58.52,43.89 62.87,43.89 63.78,44.81 65.61,44.81 66.52,43.89 CN10.8
PC6
  Top 0.254: CN10A.6 58.52,46.41 62.64,46.41 63.55,47.32 65.61,47.32 66.52,46.41 CN10.6
PC7
  Top 0.254: CN10A.21 56.01,25.83 56.92,25.83 58.06,24.69 62.87,24.69 64.01,25.83 CN10.21
PC8
  Bottom 0.254: CN10A.4 58.52,48.69 62.64,48.69 63.78,47.55 65.38,47.55 66.52,48.69 CN10.4
PC9
  Top 0.254: CN10A.3 56.01,48.69 56.92,48.69 58.06,47.55 62.87,47.55 64.01,48.69 CN10.3
PC10
  Top 0.254: CN7.3 3.43,48.92 4.34,48.92 5.49,50.06 10.29,50.06 11.43,48.92 CN7A.3
PC11
  Top 0.254: CN7.4 5.94,48.69 9.83,48.69 10.97,47.55 12.8,47.55 13.95,48.69 CN7A.4
PC12
  Top 0.254: CN7.5 3.43,46.41 4.34,46.41 5.26,47.32 10.52,47.32 11.43,46.41 CN7A.5
PC13
  Top 0.254: CN7.25 3.43,21.03 4.34,21.03 5.26,21.95 10.52,21.95 11.43,21.03 CN7A.25
PC14
  Top 0.254: CN7.27 3.43,18.06 4.34,18.06 5.26,17.14 10.52,17.14 11.43,18.06 CN7A.27
PC15
  Bottom 0.254: CN7.29 3.43,15.54 4.34,15.54 5.26,14.63 10.52,14.63 11.43,15.54 CN7A.29
PD2
  Bottom 0.254: CN7.6 5.94,46.41 10.06,46.41 10.97,47.32 13.03,47.32 13.95,46.41 CN7A.6
PHF0
  Top 0.254: CN7.31 3.43,13.03 4.34,13.03 5.49,11.89 10.29,11.89 11.43,13.03 CN7A.31
PHF1
  Bottom 0.254: CN7.33 3.43,10.52 4.34,10.52 5.49,9.37 10.29,9.37 11.43,10.52 CN7A.33
RESET
  Top 0.254: CN7.16 5.94,33.38 9.83,33.38 10.97,32.23 12.8,32.23 13.95,33.38 CN7A.16
U5V
  Bottom 0.254: CN10A.10 58.52,40.92 62.87,40.92 63.78,40.01 65.61,40.01 66.52,40.92 CN10.10
VBAT
  Top 0.254: CN7.35 3.43,8.23 4.34,8.23 5.49,9.37 10.29,9.37 11.43,8.23 CN7A.35
VDD
  Top 0.254: CN7.7 3.43,43.89 4.34,43.89 5.26,44.81 10.52,44.81 11.43,43.89 CN7A.7
VIN
  Top 0.254: 13.95,19.66 13.95,20.8 CN7A.26 | 13.95,19.66 13.95,18.29 CN7A.28 | 13.95,19.66 10.97,19.66 9.83,20.8 5.94,20.8 CN7.26

### Text on the board
tNames: STM32 Nucleo-64 Prototype Shield https://elmot.xyz/ | * | C10 | C11 | C9 | C8 | * | C12 | D2 | C6 | B8 | VDD | E5V | B9 | C5 | BOO | GND | DIP28-3 | AVDD | U5V | 3.3 | GND | GND | GND | 3.3 | IOrf | 1 | A5 | A12 | A13 | !RST | A6 | A11 | A14 | 3.3 | A7 | B12 | SSOP-28 / 0.65mm | A15 | 5.0 | B6 | B11 | GND | GND | C7 | GND | B7 | GND | 1 | A9 | B2 | C13 | VIN | DIP28-6 | A8 | B1 | C14 | VIN | 1 | B10 | B15 | C15 | A0 | B4 | B14 | HF0 | A1 | B5 | B13 | HF1 | A4 | B3 | AGND | Vbt | B0 | A10 | PC4 | C2 | C1 | A2 | AGND | C3 | C0 | SOT23-5 | A3 | AGND | 3V3
bNames: STM32 Nucleo-64 Prototype Shield https://elmot.xyz/ | * | C10 | C11 | C9 | C8 | * | C12 | D2 | C6 | B8 | VDD | E5V | B9 | C5 | BOO | GND | DIP28-3 | AVDD | U5V | 3.3 | GND | GND | GND | 3.3 | IOrf | A5 | A12 | A13 | !RST | A6 | A11 | A14 | 3.3 | A7 | B12 | A15 | 5.0 | SOP-28 / 1.27mm | B6 | B11 | GND | GND | C7 | GND | B7 | GND | A9 | B2 | C13 | VIN | A8 | B1 | C14 | VIN | B10 | B15 | C15 | A0 | B4 | B14 | HF0 | A1 | B5 | B13 | HF1 | A4 | B3 | SOT23-5 | AGND | Vbt | B0 | A10 | PC4 | C2 | C1 | A2 | AGND | C3 | C0 | A3 | AGND | 3V3